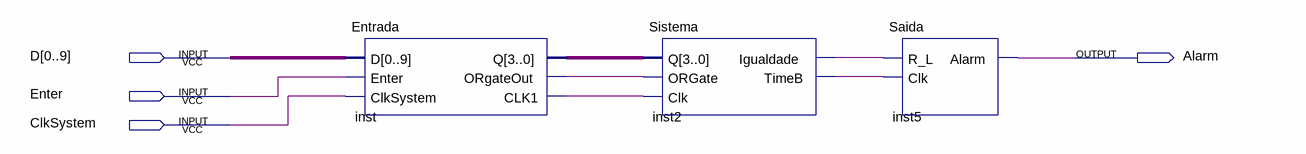
[diagram p0: schematic sheet]
// Quartus schematic projetoDigitais.bdf as structural Verilog: 3 symbols, 4 pins
module projetoDigitais (
  input  [0:9] D,
  input  Enter,
  input  ClkSystem,
  output Alarm
);

  wire inst2_igualdade, inst2_timeb, inst_clk1, inst_orgateout;
  wire [3:0] inst_q;

  Entrada inst (.D(D), .Enter(Enter), .ClkSystem(ClkSystem), .Q(inst_q), .ORgateOut(inst_orgateout), .CLK1(inst_clk1));
  Sistema inst2 (
    .Q(inst_q), .ORGate(inst_orgateout), .Clk(inst_clk1), .Igualdade(inst2_igualdade), .TimeB(inst2_timeb));
  Saida inst5 (.R_L(inst2_igualdade), .Clk(inst2_timeb), .Alarm(Alarm));
endmodule
